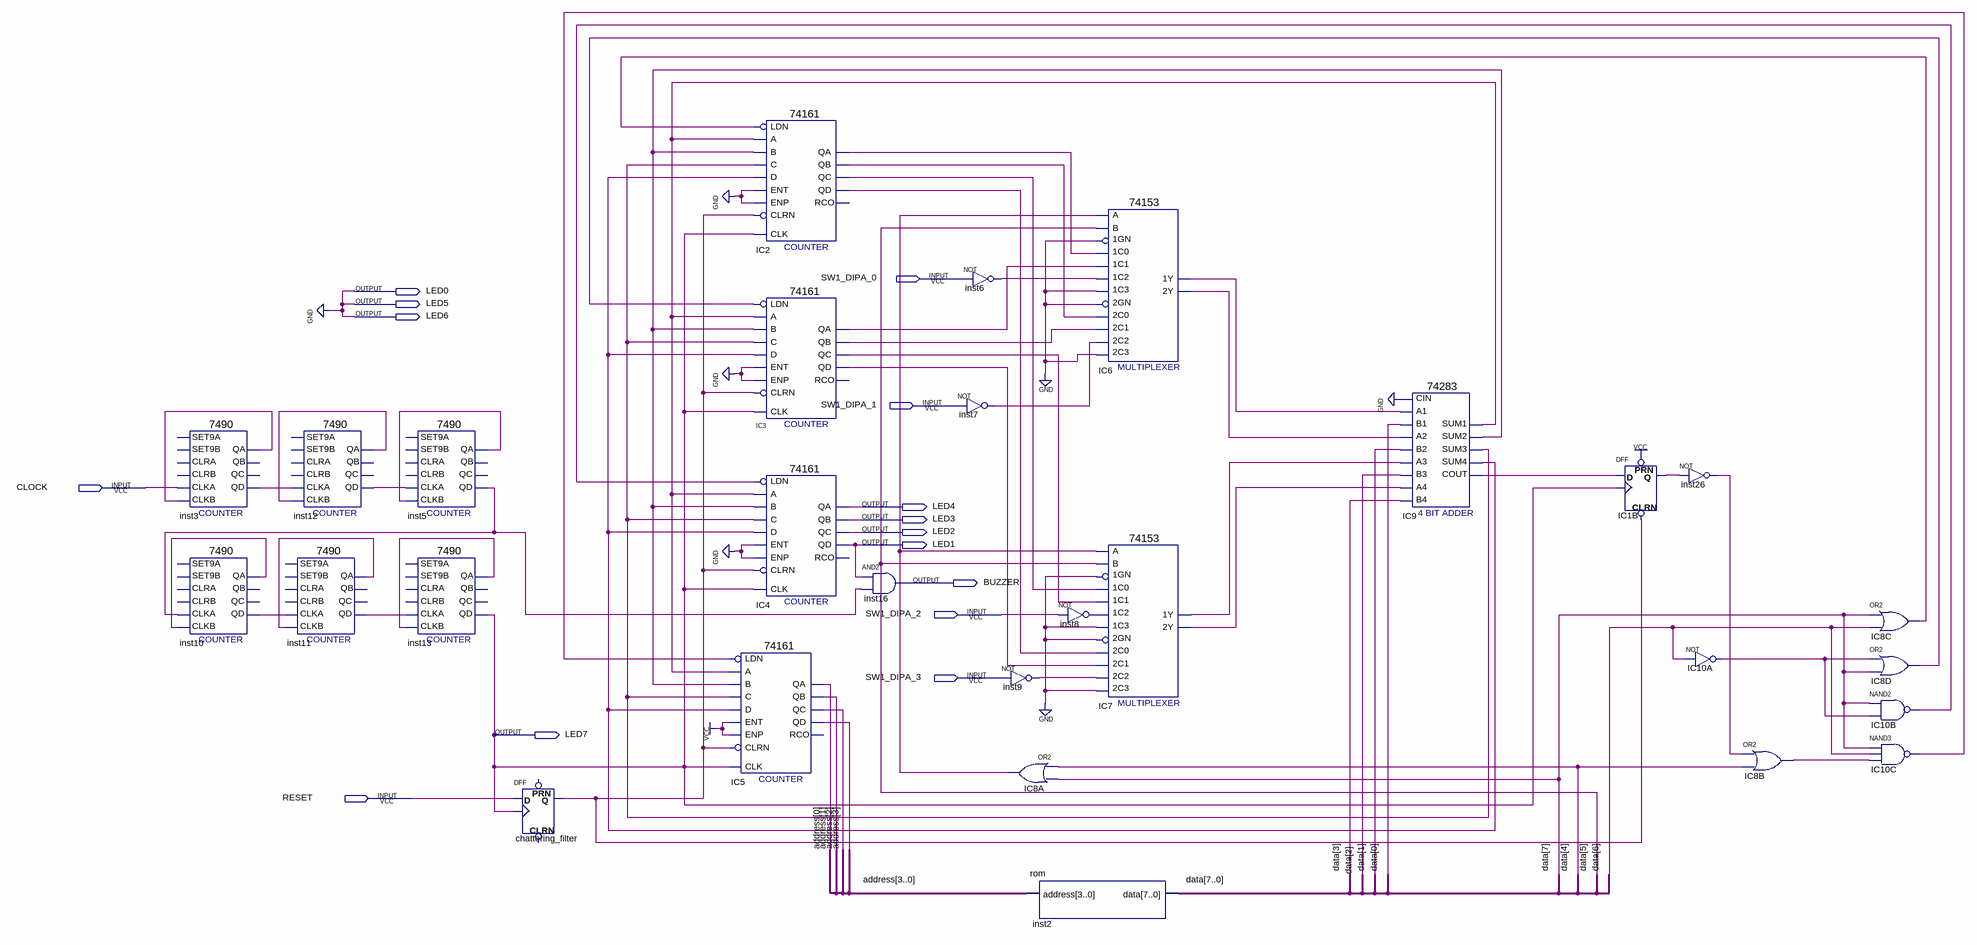
[diagram p0: schematic sheet]
// Quartus schematic td4.bdf as structural Verilog: 29 symbols, 15 pins
module td4 (
  input  SW1_DIPA_0,
  input  SW1_DIPA_1,
  input  CLOCK,
  input  SW1_DIPA_2,
  input  SW1_DIPA_3,
  input  RESET,
  output LED0,
  output LED5,
  output LED6,
  output LED4,
  output LED3,
  output LED2,
  output LED1,
  output BUZZER,
  output LED7
);

  wire chattering_filter_q, IC1B_q, IC2_qa, IC2_qb, IC2_qc, IC2_qd, IC3_qa, IC3_qb, IC3_qc, IC3_qd, IC6_1y,
       IC6_2y, IC7_1y, IC7_2y, IC8A_out, IC8B_out, IC8C_out, IC8D_out, IC9_cout, IC9_sum1, IC9_sum2,
       IC9_sum3, IC9_sum4, IC10A_out, IC10B_out, IC10C_out, inst3_qa, inst3_qd, inst5_qa, inst5_qd,
       inst6_out, inst7_out, inst8_out, inst9_out, inst10_qa, inst10_qd, inst11_qa, inst11_qd, inst12_qa,
       inst12_qd, inst13_qa, inst26_out;
  wire [3:0] address;
  wire [7:0] data;

  \7490  inst3 (.CLKB(inst3_qa), .CLKA(CLOCK), .QD(inst3_qd), .QA(inst3_qa));  // open: SET9A, CLRA, SET9B, CLRB, QB, QC
  \7490  inst10 (
    .CLKB(inst10_qa), .CLKA(inst5_qd), .QD(inst10_qd), .QA(inst10_qa));  // open: SET9A, CLRA, SET9B, CLRB, QB, QC
  \7490  inst12 (
    .CLKB(inst12_qa), .CLKA(inst3_qd), .QD(inst12_qd), .QA(inst12_qa));  // open: SET9A, CLRA, SET9B, CLRB, QB, QC
  \7490  inst11 (
    .CLKB(inst11_qa), .CLKA(inst10_qd), .QD(inst11_qd), .QA(inst11_qa));  // open: SET9A, CLRA, SET9B, CLRB, QB, QC
  \7490  inst5 (
    .CLKB(inst5_qa), .CLKA(inst12_qd), .QD(inst5_qd), .QA(inst5_qa));  // open: SET9A, CLRA, SET9B, CLRB, QB, QC
  \7490  inst13 (
    .CLKB(inst13_qa), .CLKA(inst11_qd), .QD(LED7), .QA(inst13_qa));  // open: SET9A, CLRA, SET9B, CLRB, QB, QC
  DFF chattering_filter (.CLK(LED7), .D(RESET), .Q(chattering_filter_q));  // open: CLRN, PRN
  \74161  IC5 (
    .CLRN(chattering_filter_q), .CLK(LED7), .ENP(1'b1), .LDN(IC10C_out), .A(IC9_sum1), .D(IC9_sum4),
    .ENT(1'b1), .B(IC9_sum2), .C(IC9_sum3), .QD(address[3]), .QC(address[2]), .QB(address[1]), .QA(address[0]));  // open: RCO
  \74161  IC2 (
    .CLRN(chattering_filter_q), .CLK(LED7), .ENP(1'b0), .LDN(IC8C_out), .A(IC9_sum1), .D(IC9_sum4),
    .ENT(1'b0), .B(IC9_sum2), .C(IC9_sum3), .QD(IC2_qd), .QC(IC2_qc), .QB(IC2_qb), .QA(IC2_qa));  // open: RCO
  \74161  IC3 (
    .CLRN(chattering_filter_q), .CLK(LED7), .ENP(1'b0), .LDN(IC8D_out), .A(IC9_sum1), .D(IC9_sum4),
    .ENT(1'b0), .B(IC9_sum2), .C(IC9_sum3), .QD(IC3_qd), .QC(IC3_qc), .QB(IC3_qb), .QA(IC3_qa));  // open: RCO
  \74161  IC4 (
    .CLRN(chattering_filter_q), .CLK(LED7), .ENP(1'b0), .LDN(IC10B_out), .A(IC9_sum1), .D(IC9_sum4),
    .ENT(1'b0), .B(IC9_sum2), .C(IC9_sum3), .QD(LED1), .QC(LED2), .QB(LED3), .QA(LED4));  // open: RCO
  and inst16 (BUZZER, LED1, inst5_qd);
  not inst6 (inst6_out, SW1_DIPA_0);
  not inst7 (inst7_out, SW1_DIPA_1);
  not inst9 (inst9_out, SW1_DIPA_3);
  or IC8A (IC8A_out, data[4], data[7]);
  rom inst2 (.address(address), .data(data));
  not inst8 (inst8_out, SW1_DIPA_2);
  \74153  IC6 (
    .\1C1 (IC3_qa), .\1GN (1'b0), .\1C0 (IC2_qa), .\2C0 (IC2_qb), .\2GN (1'b0), .\2C2 (inst7_out),
    .\1C2 (inst6_out), .\1C3 (1'b0), .B(data[5]), .A(IC8A_out), .\2C1 (IC3_qb), .\2C3 (1'b0), .\1Y (IC6_1y),
    .\2Y (IC6_2y));
  \74153  IC7 (
    .\1C1 (IC3_qc), .\1GN (1'b0), .\1C0 (IC2_qc), .\2C0 (IC2_qd), .\2GN (1'b0), .\2C2 (inst9_out),
    .\1C2 (inst8_out), .\1C3 (1'b0), .B(data[5]), .A(IC8A_out), .\2C1 (IC3_qd), .\2C3 (1'b0), .\1Y (IC7_1y),
    .\2Y (IC7_2y));
  \74283  IC9 (
    .CIN(1'b0), .A1(IC6_1y), .A2(IC6_2y), .B2(data[1]), .A3(IC7_1y), .A4(IC7_2y), .B4(data[3]), .B1(data[0]),
    .B3(data[2]), .SUM4(IC9_sum4), .COUT(IC9_cout), .SUM1(IC9_sum1), .SUM2(IC9_sum2), .SUM3(IC9_sum3));
  DFF IC1B (.CLRN(chattering_filter_q), .CLK(LED7), .D(IC9_cout), .PRN(1'b1), .Q(IC1B_q));
  not inst26 (inst26_out, IC1B_q);
  not IC10A (IC10A_out, data[6]);
  or IC8B (IC8B_out, inst26_out, data[4]);
  or IC8C (IC8C_out, data[7], data[6]);
  or IC8D (IC8D_out, IC10A_out, data[7]);
  nand IC10B (IC10B_out, data[7], IC10A_out);
  nand IC10C (IC10C_out, data[7], data[6], IC8B_out);

  assign LED0 = 1'b0;
  assign LED5 = 1'b0;
  assign LED6 = 1'b0;
endmodule
